# Altium project Matrix.PrjPcb
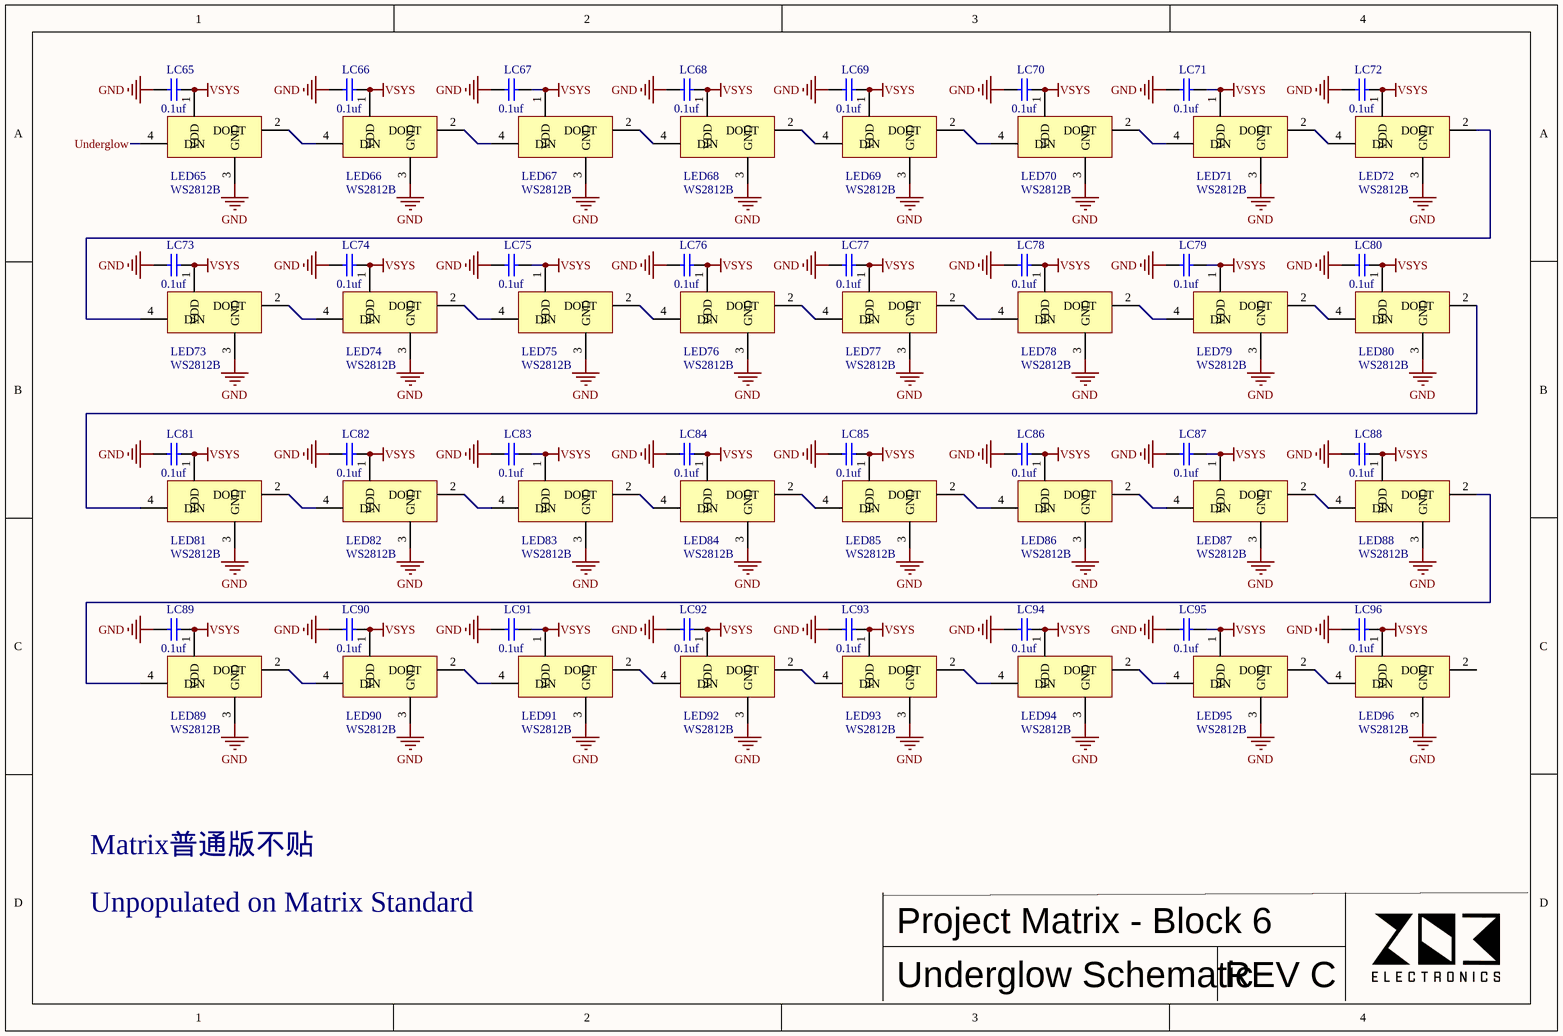
[diagram p0: Underglow.SchDoc]
4 sheets, 371 parts. Net scope: global (net labels, ports and power ports of the same name join across sheets).
Board files: TouchBarL.PcbDoc, Matrix.PcbDoc, TouchBarR.PcbDoc
Sheets:
  Underglow.SchDoc
  LED.SchDoc
  Main.SchDoc
  Keypad.SchDoc

## Sheet Underglow.SchDoc
size A4; SheetNumber: 1; SheetTotal: 4

### Parts
LC65  value 0.1uf  [0603 CAP]  (hidden comment: Cap Semi)
LC66  value 0.1uf  [0603 CAP]  (hidden comment: Cap Semi)
LC67  value 0.1uf  [0603 CAP]  (hidden comment: Cap Semi)
LC68  value 0.1uf  [0603 CAP]  (hidden comment: Cap Semi)
LC69  value 0.1uf  [0603 CAP]  (hidden comment: Cap Semi)
LC70  value 0.1uf  [0603 CAP]  (hidden comment: Cap Semi)
LC71  value 0.1uf  [0603 CAP]  (hidden comment: Cap Semi)
LC72  value 0.1uf  [0603 CAP]  (hidden comment: Cap Semi)
LC73  value 0.1uf  [0603 CAP]  (hidden comment: Cap Semi)
LC74  value 0.1uf  [0603 CAP]  (hidden comment: Cap Semi)
LC75  value 0.1uf  [0603 CAP]  (hidden comment: Cap Semi)
LC76  value 0.1uf  [0603 CAP]  (hidden comment: Cap Semi)
LC77  value 0.1uf  [0603 CAP]  (hidden comment: Cap Semi)
LC78  value 0.1uf  [0603 CAP]  (hidden comment: Cap Semi)
LC79  value 0.1uf  [0603 CAP]  (hidden comment: Cap Semi)
LC80  value 0.1uf  [0603 CAP]  (hidden comment: Cap Semi)
LC81  value 0.1uf  [0603 CAP]  (hidden comment: Cap Semi)
LC82  value 0.1uf  [0603 CAP]  (hidden comment: Cap Semi)
LC83  value 0.1uf  [0603 CAP]  (hidden comment: Cap Semi)
LC84  value 0.1uf  [0603 CAP]  (hidden comment: Cap Semi)
LC85  value 0.1uf  [0603 CAP]  (hidden comment: Cap Semi)
LC86  value 0.1uf  [0603 CAP]  (hidden comment: Cap Semi)
LC87  value 0.1uf  [0603 CAP]  (hidden comment: Cap Semi)
LC88  value 0.1uf  [0603 CAP]  (hidden comment: Cap Semi)
LC89  value 0.1uf  [0603 CAP]  (hidden comment: Cap Semi)
LC90  value 0.1uf  [0603 CAP]  (hidden comment: Cap Semi)
LC91  value 0.1uf  [0603 CAP]  (hidden comment: Cap Semi)
LC92  value 0.1uf  [0603 CAP]  (hidden comment: Cap Semi)
LC93  value 0.1uf  [0603 CAP]  (hidden comment: Cap Semi)
LC94  value 0.1uf  [0603 CAP]  (hidden comment: Cap Semi)
LC95  value 0.1uf  [0603 CAP]  (hidden comment: Cap Semi)
LC96  value 0.1uf  [0603 CAP]  (hidden comment: Cap Semi)
LED65  WS2812B  [3210 LED]
LED66  WS2812B  [3210 LED]
LED67  WS2812B  [3210 LED]
LED68  WS2812B  [3210 LED]
LED69  WS2812B  [3210 LED]
LED70  WS2812B  [3210 LED]
LED71  WS2812B  [3210 LED]
LED72  WS2812B  [3210 LED]
LED73  WS2812B  [3210 LED]
LED74  WS2812B  [3210 LED]
LED75  WS2812B  [3210 LED]
LED76  WS2812B  [3210 LED]
LED77  WS2812B  [3210 LED]
LED78  WS2812B  [3210 LED]
LED79  WS2812B  [3210 LED]
LED80  WS2812B  [3210 LED]
LED81  WS2812B  [3210 LED]
LED82  WS2812B  [3210 LED]
LED83  WS2812B  [3210 LED]
LED84  WS2812B  [3210 LED]
LED85  WS2812B  [3210 LED]
LED86  WS2812B  [3210 LED]
LED87  WS2812B  [3210 LED]
LED88  WS2812B  [3210 LED]
LED89  WS2812B  [3210 LED]
LED90  WS2812B  [3210 LED]
LED91  WS2812B  [3210 LED]
LED92  WS2812B  [3210 LED]
LED93  WS2812B  [3210 LED]
LED94  WS2812B  [3210 LED]
LED95  WS2812B  [3210 LED]
LED96  WS2812B  [3210 LED]

### Nets
GND: LC65.1 LC66.1 LC67.1 LC68.1 LC69.1 LC70.1 LC71.1 LC72.1 LC73.1 LC74.1 LC75.1 LC76.1 LC77.1 LC78.1 LC79.1 LC80.1 LC81.1 LC82.1 LC83.1 LC84.1 LC85.1 LC86.1 LC87.1 LC88.1 LC89.1 LC90.1 LC91.1 LC92.1 LC93.1 LC94.1 LC95.1 LC96.1 LED65.3(GND) LED66.3(GND) LED67.3(GND) LED68.3(GND) LED69.3(GND) LED70.3(GND) LED71.3(GND) LED72.3(GND) LED73.3(GND) LED74.3(GND) LED75.3(GND) LED76.3(GND) LED77.3(GND) LED78.3(GND) LED79.3(GND) LED80.3(GND) LED81.3(GND) LED82.3(GND) LED83.3(GND) LED84.3(GND) LED85.3(GND) LED86.3(GND) LED87.3(GND) LED88.3(GND) LED89.3(GND) LED90.3(GND) LED91.3(GND) LED92.3(GND) LED93.3(GND) LED94.3(GND) LED95.3(GND) LED96.3(GND)
VSYS: LC65.2 LC66.2 LC67.2 LC68.2 LC69.2 LC70.2 LC71.2 LC72.2 LC73.2 LC74.2 LC75.2 LC76.2 LC77.2 LC78.2 LC79.2 LC80.2 LC81.2 LC82.2 LC83.2 LC84.2 LC85.2 LC86.2 LC87.2 LC88.2 LC89.2 LC90.2 LC91.2 LC92.2 LC93.2 LC94.2 LC95.2 LC96.2 LED65.1(VDD) LED66.1(VDD) LED67.1(VDD) LED68.1(VDD) LED69.1(VDD) LED70.1(VDD) LED71.1(VDD) LED72.1(VDD) LED73.1(VDD) LED74.1(VDD) LED75.1(VDD) LED76.1(VDD) LED77.1(VDD) LED78.1(VDD) LED79.1(VDD) LED80.1(VDD) LED81.1(VDD) LED82.1(VDD) LED83.1(VDD) LED84.1(VDD) LED85.1(VDD) LED86.1(VDD) LED87.1(VDD) LED88.1(VDD) LED89.1(VDD) LED90.1(VDD) LED91.1(VDD) LED92.1(VDD) LED93.1(VDD) LED94.1(VDD) LED95.1(VDD) LED96.1(VDD)
Underglow: LED65.4(DIN)
NetLED65_2: LED65.2(DOUT) LED66.4(DIN)
NetLED66_2: LED66.2(DOUT) LED67.4(DIN)
NetLED67_2: LED67.2(DOUT) LED68.4(DIN)
NetLED68_2: LED68.2(DOUT) LED69.4(DIN)
NetLED69_2: LED69.2(DOUT) LED70.4(DIN)
NetLED70_2: LED70.2(DOUT) LED71.4(DIN)
NetLED71_2: LED71.2(DOUT) LED72.4(DIN)
NetLED72_2: LED72.2(DOUT) LED73.4(DIN)
NetLED73_2: LED73.2(DOUT) LED74.4(DIN)
NetLED74_2: LED74.2(DOUT) LED75.4(DIN)
NetLED75_2: LED75.2(DOUT) LED76.4(DIN)
NetLED76_2: LED76.2(DOUT) LED77.4(DIN)
NetLED77_2: LED77.2(DOUT) LED78.4(DIN)
NetLED78_2: LED78.2(DOUT) LED79.4(DIN)
NetLED79_2: LED79.2(DOUT) LED80.4(DIN)
NetLED80_2: LED80.2(DOUT) LED81.4(DIN)
NetLED81_2: LED81.2(DOUT) LED82.4(DIN)
NetLED82_2: LED82.2(DOUT) LED83.4(DIN)
NetLED83_2: LED83.2(DOUT) LED84.4(DIN)
NetLED84_2: LED84.2(DOUT) LED85.4(DIN)
NetLED85_2: LED85.2(DOUT) LED86.4(DIN)
NetLED86_2: LED86.2(DOUT) LED87.4(DIN)
NetLED87_2: LED87.2(DOUT) LED88.4(DIN)
NetLED88_2: LED88.2(DOUT) LED89.4(DIN)
NetLED89_2: LED89.2(DOUT) LED90.4(DIN)
NetLED90_2: LED90.2(DOUT) LED91.4(DIN)
NetLED91_2: LED91.2(DOUT) LED92.4(DIN)
NetLED92_2: LED92.2(DOUT) LED93.4(DIN)
NetLED93_2: LED93.2(DOUT) LED94.4(DIN)
NetLED94_2: LED94.2(DOUT) LED95.4(DIN)
NetLED95_2: LED95.2(DOUT) LED96.4(DIN)

Not connected (* = marked no-connect by the designer): LED96 2(DOUT)

### Notes on the sheet
- Matrix普通版不贴
- Unpopulated on Matrix Standard
- Project Matrix - Block 6
- Underglow Schematic
- REV C

### Library data of the parts
LC65-LC96 = Cap Semi: Capacitor (Semiconductor SIM Model); Published: 8-Jun-2000; LatestRevisionDate: 29-May-2009; LatestRevisionNote: IPC-7351 Footprint Added.; PackageReference: C1206; Publisher: Altium Limited; PackageDescription: Chip Capacitor
LED65-LED96 = WS2812B: 3535

## Sheet LED.SchDoc
size 304 x 330 mm; SheetNumber: 2; SheetTotal: 4
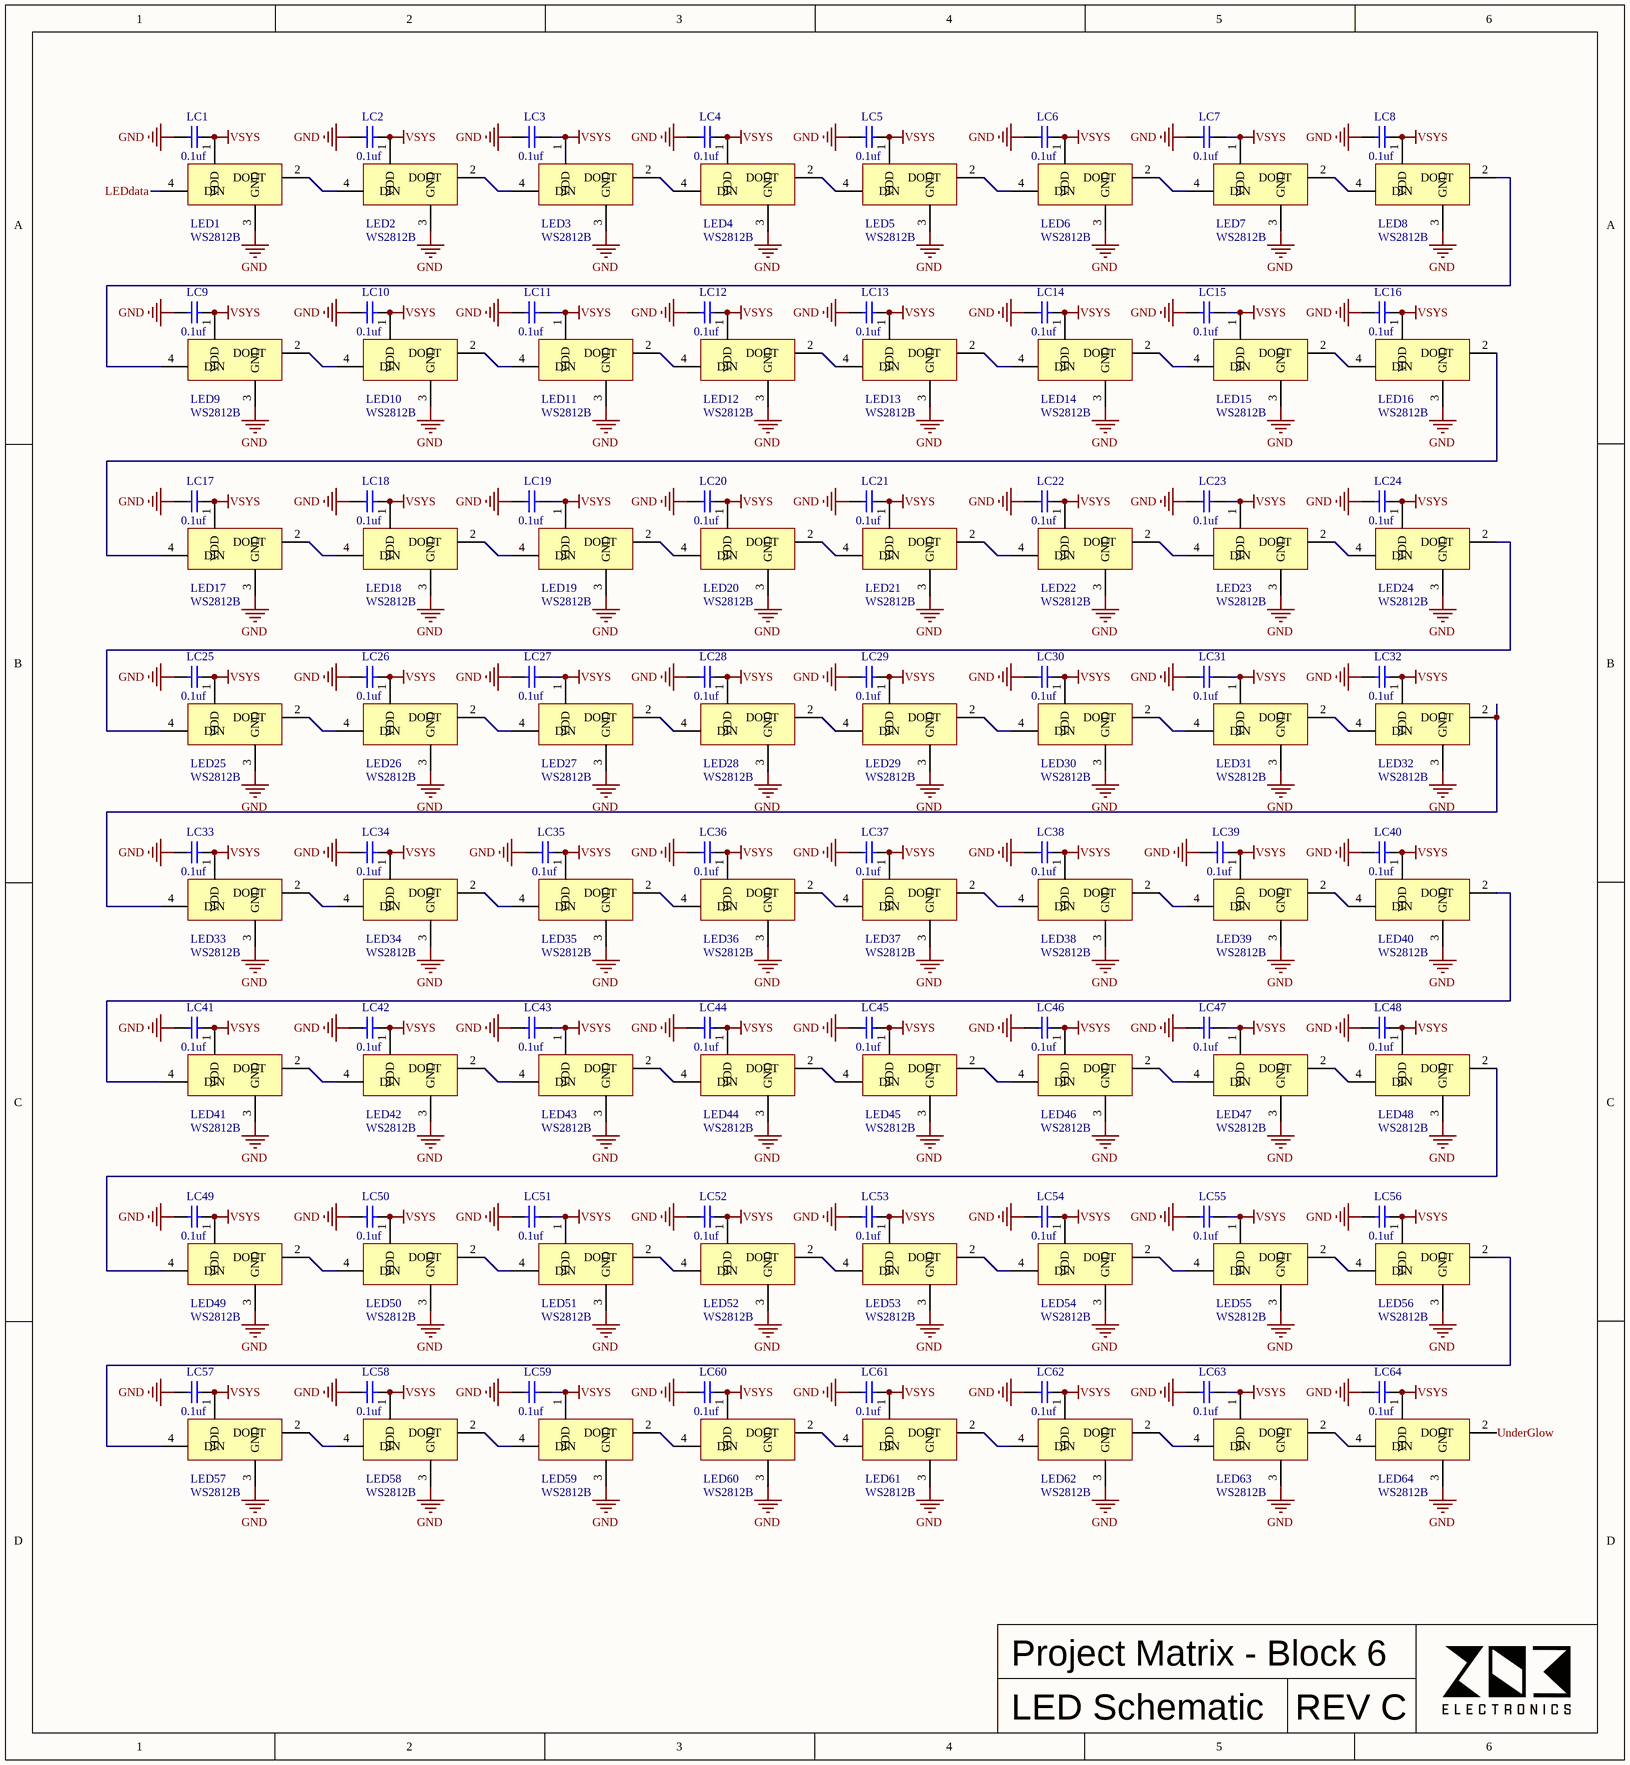
[diagram p1: LED.SchDoc]

### Parts
LC1  value 0.1uf  [0603 CAP]  (hidden comment: Cap Semi)
LC2  value 0.1uf  [0603 CAP]  (hidden comment: Cap Semi)
LC3  value 0.1uf  [0603 CAP]  (hidden comment: Cap Semi)
LC4  value 0.1uf  [0603 CAP]  (hidden comment: Cap Semi)
LC5  value 0.1uf  [0603 CAP]  (hidden comment: Cap Semi)
LC6  value 0.1uf  [0603 CAP]  (hidden comment: Cap Semi)
LC7  value 0.1uf  [0603 CAP]  (hidden comment: Cap Semi)
LC8  value 0.1uf  [0603 CAP]  (hidden comment: Cap Semi)
LC9  value 0.1uf  [0603 CAP]  (hidden comment: Cap Semi)
LC10  value 0.1uf  [0603 CAP]  (hidden comment: Cap Semi)
LC11  value 0.1uf  [0603 CAP]  (hidden comment: Cap Semi)
LC12  value 0.1uf  [0603 CAP]  (hidden comment: Cap Semi)
LC13  value 0.1uf  [0603 CAP]  (hidden comment: Cap Semi)
LC14  value 0.1uf  [0603 CAP]  (hidden comment: Cap Semi)
LC15  value 0.1uf  [0603 CAP]  (hidden comment: Cap Semi)
LC16  value 0.1uf  [0603 CAP]  (hidden comment: Cap Semi)
LC17  value 0.1uf  [0603 CAP]  (hidden comment: Cap Semi)
LC18  value 0.1uf  [0603 CAP]  (hidden comment: Cap Semi)
LC19  value 0.1uf  [0603 CAP]  (hidden comment: Cap Semi)
LC20  value 0.1uf  [0603 CAP]  (hidden comment: Cap Semi)
LC21  value 0.1uf  [0603 CAP]  (hidden comment: Cap Semi)
LC22  value 0.1uf  [0603 CAP]  (hidden comment: Cap Semi)
LC23  value 0.1uf  [0603 CAP]  (hidden comment: Cap Semi)
LC24  value 0.1uf  [0603 CAP]  (hidden comment: Cap Semi)
LC25  value 0.1uf  [0603 CAP]  (hidden comment: Cap Semi)
LC26  value 0.1uf  [0603 CAP]  (hidden comment: Cap Semi)
LC27  value 0.1uf  [0603 CAP]  (hidden comment: Cap Semi)
LC28  value 0.1uf  [0603 CAP]  (hidden comment: Cap Semi)
LC29  value 0.1uf  [0603 CAP]  (hidden comment: Cap Semi)
LC30  value 0.1uf  [0603 CAP]  (hidden comment: Cap Semi)
LC31  value 0.1uf  [0603 CAP]  (hidden comment: Cap Semi)
LC32  value 0.1uf  [0603 CAP]  (hidden comment: Cap Semi)
LC33  value 0.1uf  [0603 CAP]  (hidden comment: Cap Semi)
LC34  value 0.1uf  [0603 CAP]  (hidden comment: Cap Semi)
LC35  value 0.1uf  [0603 CAP]  (hidden comment: Cap Semi)
LC36  value 0.1uf  [0603 CAP]  (hidden comment: Cap Semi)
LC37  value 0.1uf  [0603 CAP]  (hidden comment: Cap Semi)
LC38  value 0.1uf  [0603 CAP]  (hidden comment: Cap Semi)
LC39  value 0.1uf  [0603 CAP]  (hidden comment: Cap Semi)
LC40  value 0.1uf  [0603 CAP]  (hidden comment: Cap Semi)
LC41  value 0.1uf  [0603 CAP]  (hidden comment: Cap Semi)
LC42  value 0.1uf  [0603 CAP]  (hidden comment: Cap Semi)
LC43  value 0.1uf  [0603 CAP]  (hidden comment: Cap Semi)
LC44  value 0.1uf  [0603 CAP]  (hidden comment: Cap Semi)
LC45  value 0.1uf  [0603 CAP]  (hidden comment: Cap Semi)
LC46  value 0.1uf  [0603 CAP]  (hidden comment: Cap Semi)
LC47  value 0.1uf  [0603 CAP]  (hidden comment: Cap Semi)
LC48  value 0.1uf  [0603 CAP]  (hidden comment: Cap Semi)
LC49  value 0.1uf  [0603 CAP]  (hidden comment: Cap Semi)
LC50  value 0.1uf  [0603 CAP]  (hidden comment: Cap Semi)
LC51  value 0.1uf  [0603 CAP]  (hidden comment: Cap Semi)
LC52  value 0.1uf  [0603 CAP]  (hidden comment: Cap Semi)
LC53  value 0.1uf  [0603 CAP]  (hidden comment: Cap Semi)
LC54  value 0.1uf  [0603 CAP]  (hidden comment: Cap Semi)
LC55  value 0.1uf  [0603 CAP]  (hidden comment: Cap Semi)
LC56  value 0.1uf  [0603 CAP]  (hidden comment: Cap Semi)
LC57  value 0.1uf  [0603 CAP]  (hidden comment: Cap Semi)
LC58  value 0.1uf  [0603 CAP]  (hidden comment: Cap Semi)
LC59  value 0.1uf  [0603 CAP]  (hidden comment: Cap Semi)
LC60  value 0.1uf  [0603 CAP]  (hidden comment: Cap Semi)
LC61  value 0.1uf  [0603 CAP]  (hidden comment: Cap Semi)
LC62  value 0.1uf  [0603 CAP]  (hidden comment: Cap Semi)
LC63  value 0.1uf  [0603 CAP]  (hidden comment: Cap Semi)
LC64  value 0.1uf  [0603 CAP]  (hidden comment: Cap Semi)
LED1  WS2812B  [WS2812B]
LED2  WS2812B  [WS2812B]
LED3  WS2812B  [WS2812B]
LED4  WS2812B  [WS2812B]
LED5  WS2812B  [WS2812B]
LED6  WS2812B  [WS2812B]
LED7  WS2812B  [WS2812B]
LED8  WS2812B  [WS2812B]
LED9  WS2812B  [WS2812B]
LED10  WS2812B  [WS2812B]
LED11  WS2812B  [WS2812B]
LED12  WS2812B  [WS2812B]
LED13  WS2812B  [WS2812B]
LED14  WS2812B  [WS2812B]
LED15  WS2812B  [WS2812B]
LED16  WS2812B  [WS2812B]
LED17  WS2812B  [WS2812B]
LED18  WS2812B  [WS2812B]
LED19  WS2812B  [WS2812B]
LED20  WS2812B  [WS2812B]
LED21  WS2812B  [WS2812B]
LED22  WS2812B  [WS2812B]
LED23  WS2812B  [WS2812B]
LED24  WS2812B  [WS2812B]
LED25  WS2812B  [WS2812B]
LED26  WS2812B  [WS2812B]
LED27  WS2812B  [WS2812B]
LED28  WS2812B  [WS2812B]
LED29  WS2812B  [WS2812B]
LED30  WS2812B  [WS2812B]
LED31  WS2812B  [WS2812B]
LED32  WS2812B  [WS2812B]
LED33  WS2812B  [WS2812B]
LED34  WS2812B  [WS2812B]
LED35  WS2812B  [WS2812B]
LED36  WS2812B  [WS2812B]
LED37  WS2812B  [WS2812B]
LED38  WS2812B  [WS2812B]
LED39  WS2812B  [WS2812B]
LED40  WS2812B  [WS2812B]
LED41  WS2812B  [WS2812B]
LED42  WS2812B  [WS2812B]
LED43  WS2812B  [WS2812B]
LED44  WS2812B  [WS2812B]
LED45  WS2812B  [WS2812B]
LED46  WS2812B  [WS2812B]
LED47  WS2812B  [WS2812B]
LED48  WS2812B  [WS2812B]
LED49  WS2812B  [WS2812B]
LED50  WS2812B  [WS2812B]
LED51  WS2812B  [WS2812B]
LED52  WS2812B  [WS2812B]
LED53  WS2812B  [WS2812B]
LED54  WS2812B  [WS2812B]
LED55  WS2812B  [WS2812B]
LED56  WS2812B  [WS2812B]
LED57  WS2812B  [WS2812B]
LED58  WS2812B  [WS2812B]
LED59  WS2812B  [WS2812B]
LED60  WS2812B  [WS2812B]
LED61  WS2812B  [WS2812B]
LED62  WS2812B  [WS2812B]
LED63  WS2812B  [WS2812B]
LED64  WS2812B  [WS2812B]

### Nets
GND: LC1.1 LC2.1 LC3.1 LC4.1 LC5.1 LC6.1 LC7.1 LC8.1 LC9.1 LC10.1 LC11.1 LC12.1 LC13.1 LC14.1 LC15.1 LC16.1 LC17.1 LC18.1 LC19.1 LC20.1 LC21.1 LC22.1 LC23.1 LC24.1 LC25.1 LC26.1 LC27.1 LC28.1 LC29.1 LC30.1 LC31.1 LC32.1 LC33.1 LC34.1 LC35.1 LC36.1 LC37.1 LC38.1 LC39.1 LC40.1 LC41.1 LC42.1 LC43.1 LC44.1 LC45.1 LC46.1 LC47.1 LC48.1 LC49.1 LC50.1 LC51.1 LC52.1 LC53.1 LC54.1 LC55.1 LC56.1 LC57.1 LC58.1 LC59.1 LC60.1 LC61.1 LC62.1 LC63.1 LC64.1 LED1.3(GND) LED2.3(GND) LED3.3(GND) LED4.3(GND) LED5.3(GND) LED6.3(GND) LED7.3(GND) LED8.3(GND) LED9.3(GND) LED10.3(GND) LED11.3(GND) LED12.3(GND) LED13.3(GND) LED14.3(GND) LED15.3(GND) LED16.3(GND) LED17.3(GND) LED18.3(GND) LED19.3(GND) LED20.3(GND) LED21.3(GND) LED22.3(GND) LED23.3(GND) LED24.3(GND) LED25.3(GND) LED26.3(GND) LED27.3(GND) LED28.3(GND) LED29.3(GND) LED30.3(GND) LED31.3(GND) LED32.3(GND) LED33.3(GND) LED34.3(GND) LED35.3(GND) LED36.3(GND) LED37.3(GND) LED38.3(GND) LED39.3(GND) LED40.3(GND) LED41.3(GND) LED42.3(GND) LED43.3(GND) LED44.3(GND) LED45.3(GND) LED46.3(GND) LED47.3(GND) LED48.3(GND) LED49.3(GND) LED50.3(GND) LED51.3(GND) LED52.3(GND) LED53.3(GND) LED54.3(GND) LED55.3(GND) LED56.3(GND) LED57.3(GND) LED58.3(GND) LED59.3(GND) LED60.3(GND) LED61.3(GND) LED62.3(GND) LED63.3(GND) LED64.3(GND)
VSYS: LC1.2 LC2.2 LC3.2 LC4.2 LC5.2 LC6.2 LC7.2 LC8.2 LC9.2 LC10.2 LC11.2 LC12.2 LC13.2 LC14.2 LC15.2 LC16.2 LC17.2 LC18.2 LC19.2 LC20.2 LC21.2 LC22.2 LC23.2 LC24.2 LC25.2 LC26.2 LC27.2 LC28.2 LC29.2 LC30.2 LC31.2 LC32.2 LC33.2 LC34.2 LC35.2 LC36.2 LC37.2 LC38.2 LC39.2 LC40.2 LC41.2 LC42.2 LC43.2 LC44.2 LC45.2 LC46.2 LC47.2 LC48.2 LC49.2 LC50.2 LC51.2 LC52.2 LC53.2 LC54.2 LC55.2 LC56.2 LC57.2 LC58.2 LC59.2 LC60.2 LC61.2 LC62.2 LC63.2 LC64.2 LED1.1(VDD) LED2.1(VDD) LED3.1(VDD) LED4.1(VDD) LED5.1(VDD) LED6.1(VDD) LED7.1(VDD) LED8.1(VDD) LED9.1(VDD) LED10.1(VDD) LED11.1(VDD) LED12.1(VDD) LED13.1(VDD) LED14.1(VDD) LED15.1(VDD) LED16.1(VDD) LED17.1(VDD) LED18.1(VDD) LED19.1(VDD) LED20.1(VDD) LED21.1(VDD) LED22.1(VDD) LED23.1(VDD) LED24.1(VDD) LED25.1(VDD) LED26.1(VDD) LED27.1(VDD) LED28.1(VDD) LED29.1(VDD) LED30.1(VDD) LED31.1(VDD) LED32.1(VDD) LED33.1(VDD) LED34.1(VDD) LED35.1(VDD) LED36.1(VDD) LED37.1(VDD) LED38.1(VDD) LED39.1(VDD) LED40.1(VDD) LED41.1(VDD) LED42.1(VDD) LED43.1(VDD) LED44.1(VDD) LED45.1(VDD) LED46.1(VDD) LED47.1(VDD) LED48.1(VDD) LED49.1(VDD) LED50.1(VDD) LED51.1(VDD) LED52.1(VDD) LED53.1(VDD) LED54.1(VDD) LED55.1(VDD) LED56.1(VDD) LED57.1(VDD) LED58.1(VDD) LED59.1(VDD) LED60.1(VDD) LED61.1(VDD) LED62.1(VDD) LED63.1(VDD) LED64.1(VDD)
LEDdata: LED1.4(DIN)
Underglow: LED64.2(DOUT)
NetLED1_2: LED1.2(DOUT) LED2.4(DIN)
NetLED2_2: LED2.2(DOUT) LED3.4(DIN)
NetLED3_2: LED3.2(DOUT) LED4.4(DIN)
NetLED4_2: LED4.2(DOUT) LED5.4(DIN)
NetLED5_2: LED5.2(DOUT) LED6.4(DIN)
NetLED6_2: LED6.2(DOUT) LED7.4(DIN)
NetLED7_2: LED7.2(DOUT) LED8.4(DIN)
NetLED8_2: LED8.2(DOUT) LED9.4(DIN)
NetLED9_2: LED9.2(DOUT) LED10.4(DIN)
NetLED10_2: LED10.2(DOUT) LED11.4(DIN)
NetLED11_2: LED11.2(DOUT) LED12.4(DIN)
NetLED12_2: LED12.2(DOUT) LED13.4(DIN)
NetLED13_2: LED13.2(DOUT) LED14.4(DIN)
NetLED14_2: LED14.2(DOUT) LED15.4(DIN)
NetLED15_2: LED15.2(DOUT) LED16.4(DIN)
NetLED16_2: LED16.2(DOUT) LED17.4(DIN)
NetLED17_2: LED17.2(DOUT) LED18.4(DIN)
NetLED18_2: LED18.2(DOUT) LED19.4(DIN)
NetLED19_2: LED19.2(DOUT) LED20.4(DIN)
NetLED20_2: LED20.2(DOUT) LED21.4(DIN)
NetLED21_2: LED21.2(DOUT) LED22.4(DIN)
NetLED22_2: LED22.2(DOUT) LED23.4(DIN)
NetLED23_2: LED23.2(DOUT) LED24.4(DIN)
NetLED24_2: LED24.2(DOUT) LED25.4(DIN)
NetLED25_2: LED25.2(DOUT) LED26.4(DIN)
NetLED26_2: LED26.2(DOUT) LED27.4(DIN)
NetLED27_2: LED27.2(DOUT) LED28.4(DIN)
NetLED28_2: LED28.2(DOUT) LED29.4(DIN)
NetLED29_2: LED29.2(DOUT) LED30.4(DIN)
NetLED30_2: LED30.2(DOUT) LED31.4(DIN)
NetLED31_2: LED31.2(DOUT) LED32.4(DIN)
NetLED32_2: LED32.2(DOUT) LED33.4(DIN)
NetLED33_2: LED33.2(DOUT) LED34.4(DIN)
NetLED34_2: LED34.2(DOUT) LED35.4(DIN)
NetLED35_2: LED35.2(DOUT) LED36.4(DIN)
NetLED36_2: LED36.2(DOUT) LED37.4(DIN)
NetLED37_2: LED37.2(DOUT) LED38.4(DIN)
NetLED38_2: LED38.2(DOUT) LED39.4(DIN)
NetLED39_2: LED39.2(DOUT) LED40.4(DIN)
NetLED40_2: LED40.2(DOUT) LED41.4(DIN)
NetLED41_2: LED41.2(DOUT) LED42.4(DIN)
NetLED42_2: LED42.2(DOUT) LED43.4(DIN)
NetLED43_2: LED43.2(DOUT) LED44.4(DIN)
NetLED44_2: LED44.2(DOUT) LED45.4(DIN)
NetLED45_2: LED45.2(DOUT) LED46.4(DIN)
NetLED46_2: LED46.2(DOUT) LED47.4(DIN)
NetLED47_2: LED47.2(DOUT) LED48.4(DIN)
NetLED48_2: LED48.2(DOUT) LED49.4(DIN)
NetLED49_2: LED49.2(DOUT) LED50.4(DIN)
NetLED50_2: LED50.2(DOUT) LED51.4(DIN)
NetLED51_2: LED51.2(DOUT) LED52.4(DIN)
NetLED52_2: LED52.2(DOUT) LED53.4(DIN)
NetLED53_2: LED53.2(DOUT) LED54.4(DIN)
NetLED54_2: LED54.2(DOUT) LED55.4(DIN)
NetLED55_2: LED55.2(DOUT) LED56.4(DIN)
NetLED56_2: LED56.2(DOUT) LED57.4(DIN)
NetLED57_2: LED57.2(DOUT) LED58.4(DIN)
NetLED58_2: LED58.2(DOUT) LED59.4(DIN)
NetLED59_2: LED59.2(DOUT) LED60.4(DIN)
NetLED60_2: LED60.2(DOUT) LED61.4(DIN)
NetLED61_2: LED61.2(DOUT) LED62.4(DIN)
NetLED62_2: LED62.2(DOUT) LED63.4(DIN)
NetLED63_2: LED63.2(DOUT) LED64.4(DIN)

### Notes on the sheet
- Project Matrix - Block 6
- LED Schematic
- REV C

### Library data of the parts
LC1-LC64 = Cap Semi: Capacitor (Semiconductor SIM Model); Published: 8-Jun-2000; LatestRevisionDate: 29-May-2009; LatestRevisionNote: IPC-7351 Footprint Added.; PackageReference: C1206; Publisher: Altium Limited; PackageDescription: Chip Capacitor
LED1-LED64 = WS2812B: 3535

## Sheet Main.SchDoc: 203 Matrix - Core
size 320 x 193 mm; Revision: FE V1.0; SheetNumber: 3; SheetTotal: 4
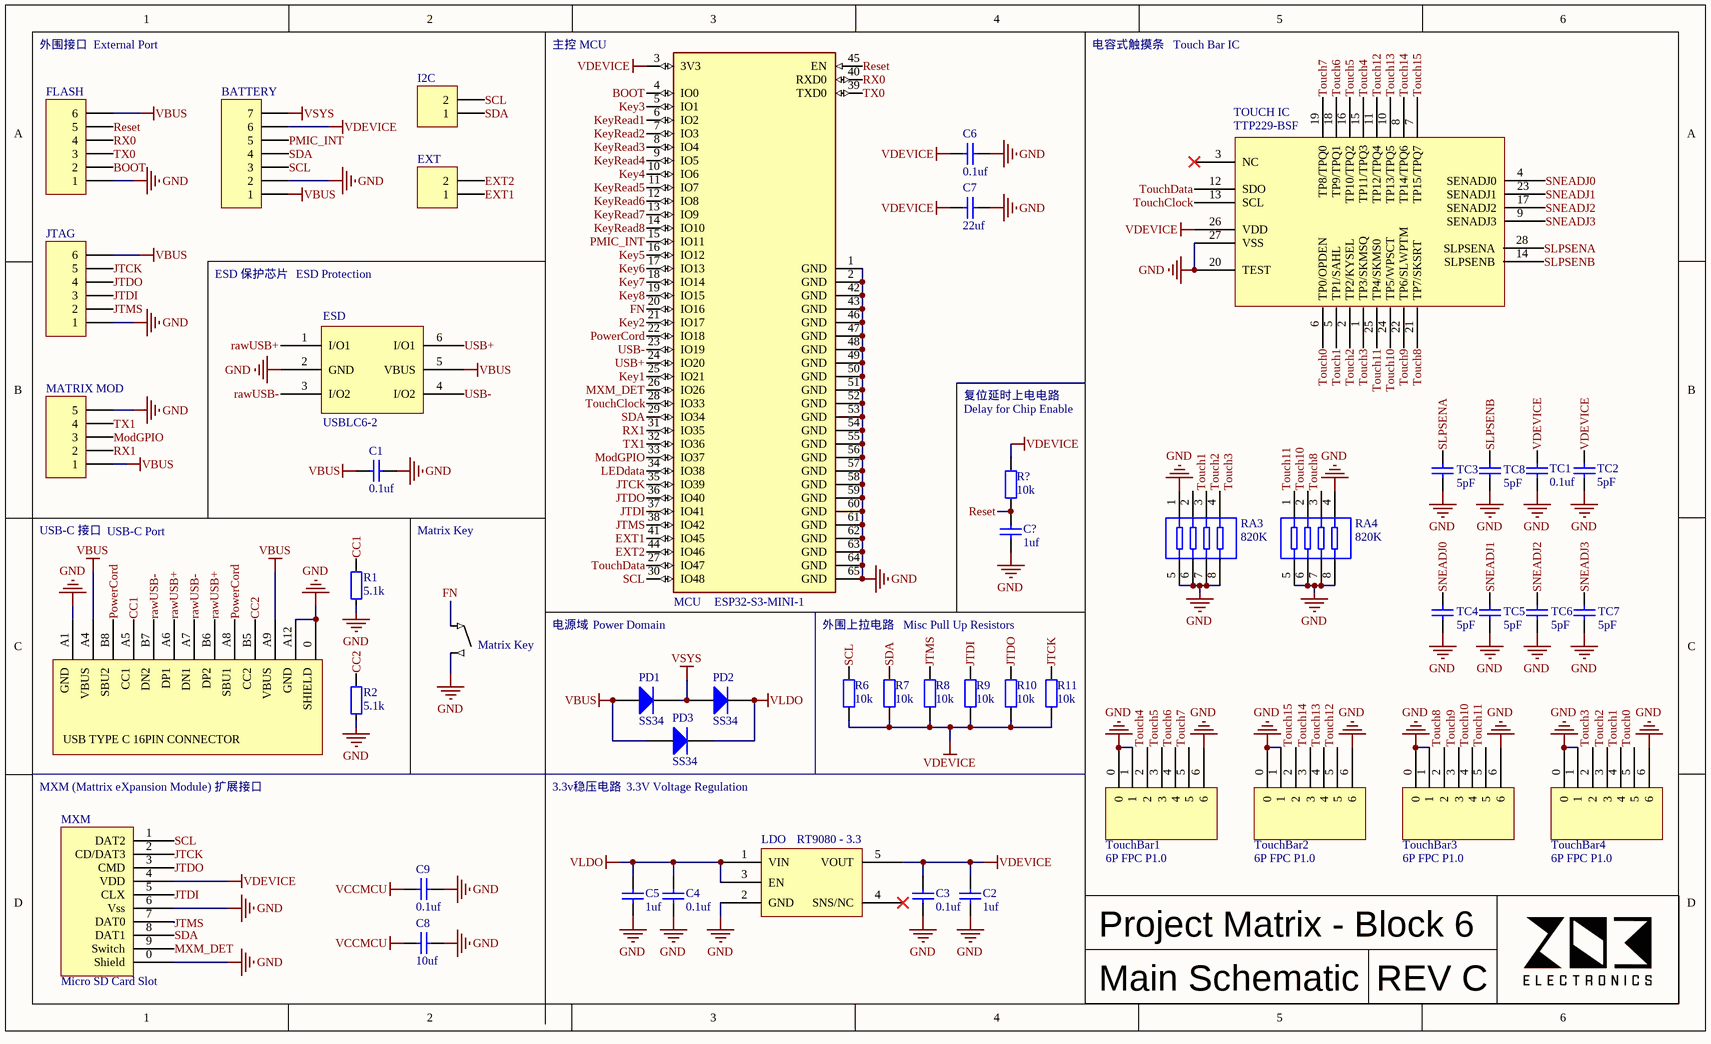
[diagram p2: Main.SchDoc]

### Parts
(Parts that share a designator on the sheet are numbered #1, #2 ... from top to bottom, then left to right.)
BATTERY  (no value)  [HDR1X7]
C1  value 0.1uf  [0603 CAP]  (hidden comment: MCU)
C2  value 1uf  [0603 CAP]  (hidden comment: MCU)
C3  value 0.1uf  [0603 CAP]  (hidden comment: MCU)
C4  value 0.1uf  [0603 CAP]  (hidden comment: MCU)
C5  value 1uf  [0603 CAP]  (hidden comment: MCU)
C6  value 0.1uf  [0603 CAP]  (hidden comment: MCU)
C7  value 22uf  [0603 CAP]  (hidden comment: LDO)
C8  value 10uf  [0603 CAP]  (hidden comment: MCU)
C9  value 0.1uf  [0603 CAP]  (hidden comment: MCU)
C?  value 1uf  [0603 CAP]  (hidden comment: LDO)
ESD  USBLC6-2  [SOT23-6L]
EXT  Header 2  [HDR1X2]  (value not drawn)
I2C  Header 2  [HDR1X2]  (value not drawn)
JTAG#1  FLASH  [HDR1X6]
JTAG#2  Interface to flash ESP  [HDR1X6]  (value not drawn)
LDO  RT9080 - 3.3  [SOT23-5]
Matrix_Key  Comment  [sw5x5]  (value not drawn)
MATRIX_MOD  MHDR1X5  [MHDR1X5]  (value not drawn)
MCU  ESP32-S3-MINI-1  [ESP32-S3-MINI-1]
MXM  Micro SD Card Slot  [TF Slot 2]
PD1  SS34  [SOD123]
PD2  SS34  [SOD123]
PD3  SS34  [SOD123]
R1  value 5.1k  [0603 res]  (hidden comment: MCU)
R2  value 5.1k  [0603 res]  (hidden comment: MCU)
R6  value 10k  [0603 res]  (hidden comment: MCU)
R7  value 10k  [0603 res]  (hidden comment: MCU)
R8  value 10k  [0603 res]  (hidden comment: MCU)
R9  value 10k  [0603 res]  (hidden comment: MCU)
R10  value 10k  [0603 res]  (hidden comment: MCU)
R11  value 10k  [0603 res]  (hidden comment: MCU)
R?  value 10k  [0603 res]  (hidden comment: MCU)
RA3  value 820K  [8P4R]  (hidden comment: Touch Bar)
RA4  value 820K  [8P4R]  (hidden comment: Touch Bar)
TC1  value 0.1uf  [0603 CAP]  (hidden comment: Touch Bar)
TC2  value 5pF  [0603 CAP]  (hidden comment: Touch Bar)
TC3  value 5pF  [0603 CAP]  (hidden comment: Touch Bar)
TC4  value 5pF  [0603 CAP]  (hidden comment: Touch Bar)
TC5  value 5pF  [0603 CAP]  (hidden comment: Touch Bar)
TC6  value 5pF  [0603 CAP]  (hidden comment: Touch Bar)
TC7  value 5pF  [0603 CAP]  (hidden comment: Touch Bar)
TC8  value 5pF  [0603 CAP]  (hidden comment: Touch Bar)
TOUCH_IC  TTP229-BSF  [SSOP-28]
TouchBar1  6P FPC P1.0  [6Pin FPC 1.0mm]
TouchBar2  6P FPC P1.0  [6Pin FPC 1.0mm]
TouchBar3  6P FPC P1.0  [6Pin FPC 1.0mm]
TouchBar4  6P FPC P1.0  [6Pin FPC 1.0mm]
USB-C  USBC 16PIN  [USBC short]  (value not drawn)

### Nets
GND: BATTERY.2 C1.1 C2.1 C3.1 C4.2 C5.2 C6.1 C7.1 C8.2 C9.2 C?.2 ESD.2(GND) JTAG#1.1 JTAG#2.1 LDO.2(GND) Matrix_Key.2(Out) MATRIX_MOD.5 MCU.1(GND) MCU.2(GND) MCU.42(GND) MCU.43(GND) MCU.46(GND) MCU.47(GND) MCU.48(GND) MCU.49(GND) MCU.50(GND) MCU.51(GND) MCU.52(GND) MCU.53(GND) MCU.54(GND) MCU.55(GND) MCU.56(GND) MCU.57(GND) MCU.58(GND) MCU.59(GND) MCU.60(GND) MCU.61(GND) MCU.62(GND) MCU.63(GND) MCU.64(GND) MCU.65(GND) MXM.0(Shield) MXM.6(Vss) R1.2 R2.1 RA3.1 RA3.5 RA3.6 RA3.7 RA3.8 RA4.4 RA4.5 RA4.6 RA4.7 RA4.8 TC1.1 TC2.1 TC3.1 TC4.1 TC5.1 TC6.1 TC7.1 TC8.1 TOUCH_IC.20(TEST) TOUCH_IC.27(VSS) TouchBar1.0 TouchBar1.1 TouchBar1.6 TouchBar2.0 TouchBar2.1 TouchBar2.6 TouchBar3.0 TouchBar3.1 TouchBar3.6 TouchBar4.0 TouchBar4.1 TouchBar4.6 USB-C.0 USB-C.A1 USB-C.A12
VBUS: BATTERY.1 C1.2 ESD.5(VBUS) JTAG#1.6 JTAG#2.6 MATRIX_MOD.1 PD1.1(A) PD3.1(A) USB-C.A4 USB-C.A9
VCCMCU: C8.1 C9.1
VDEVICE: BATTERY.6 C2.2 C3.2 C6.2 C7.2 LDO.5(VOUT) MCU.3(3V3) MXM.4(VDD) R6.1 R7.1 R8.1 R9.1 R10.1 R11.1 R?.1 TC1.2 TC2.2 TOUCH_IC.26(VDD)
VLDO: C4.1 C5.1 LDO.1(VIN) LDO.3(EN) PD2.2(K) PD3.2(K)
VSYS: BATTERY.7 PD1.2(K) PD2.1(A)
BOOT: JTAG#1.2 MCU.4(IO0)
CC1: R1.1 USB-C.A5
CC2: R2.2 USB-C.B5
EXT1: EXT.1 MCU.41(IO45)
EXT2: EXT.2 MCU.44(IO46)
FN: Matrix_Key.1 MCU.20(IO16)
JTCK: JTAG#2.5 MCU.35(IO39) MXM.2(CD/DAT3) R11.2
JTDI: JTAG#2.3 MCU.37(IO41) MXM.5(CLX) R9.2
JTDO: JTAG#2.4 MCU.36(IO40) MXM.3(CMD) R10.2
JTMS: JTAG#2.2 MCU.38(IO42) MXM.7(DAT0) R8.2
Key1: MCU.25(IO21)
Key2: MCU.21(IO17)
Key3: MCU.5(IO1)
Key4: MCU.10(IO6)
Key5: MCU.16(IO12)
Key6: MCU.17(IO13)
Key7: MCU.18(IO14)
Key8: MCU.19(IO15)
KeyRead1: MCU.6(IO2)
KeyRead2: MCU.7(IO3)
KeyRead3: MCU.8(IO4)
KeyRead4: MCU.9(IO5)
KeyRead5: MCU.11(IO7)
KeyRead6: MCU.12(IO8)
KeyRead7: MCU.13(IO9)
KeyRead8: MCU.14(IO10)
LEDdata: MCU.34(IO38)
ModGPIO: MATRIX_MOD.3 MCU.33(IO37)
MXM_DET: MCU.26(IO26) MXM.9(Switch)
PMIC_INT: BATTERY.5 MCU.15(IO11)
PowerCord: MCU.22(IO18) USB-C.A8 USB-C.B8
rawUSB+: ESD.1(I/O1) USB-C.A6 USB-C.B6
rawUSB-: ESD.3(I/O2) USB-C.A7 USB-C.B7
Reset: C?.1 JTAG#1.5 MCU.45(EN) R?.2
RX0: JTAG#1.4 MCU.40(RXD0)
RX1: MATRIX_MOD.2 MCU.31(IO35)
SCL: BATTERY.3 I2C.2 MCU.30(IO48) MXM.1(DAT2) R6.2
SDA: BATTERY.4 I2C.1 MCU.29(IO34) MXM.8(DAT1) R7.2
SLPSENA: TC3.2 TOUCH_IC.28(SLPSENA)
SLPSENB: TC8.2 TOUCH_IC.14(SLPSENB)
SNEADJ0: TC4.2 TOUCH_IC.4(SENADJ0)
SNEADJ1: TC5.2 TOUCH_IC.23(SENADJ1)
SNEADJ2: TC6.2 TOUCH_IC.17(SENADJ2)
SNEADJ3: TC7.2 TOUCH_IC.9(SENADJ3)
Touch0: TOUCH_IC.6(TP0/OPDEN) TouchBar4.5
Touch1: RA3.2 TOUCH_IC.5(TP1/SAHL) TouchBar4.4
Touch2: RA3.3 TOUCH_IC.2(TP2/KYSEL) TouchBar4.3
Touch3: RA3.4 TOUCH_IC.1(TP3/SKMSQ) TouchBar4.2
Touch4: TOUCH_IC.15(TP11/TPQ3) TouchBar1.2
Touch5: TOUCH_IC.16(TP10/TPQ2) TouchBar1.3
Touch6: TOUCH_IC.18(TP9/TPQ1) TouchBar1.4
Touch7: TOUCH_IC.19(TP8/TPQ0) TouchBar1.5
Touch8: RA4.3 TOUCH_IC.21(TP7/SKSRT) TouchBar3.2
Touch9: TOUCH_IC.22(TP6/SLWPTM) TouchBar3.3
Touch10: RA4.2 TOUCH_IC.24(TP5/WPSCT) TouchBar3.4
Touch11: RA4.1 TOUCH_IC.25(TP4/SKMS0) TouchBar3.5
Touch12: TOUCH_IC.11(TP12/TPQ4) TouchBar2.5
Touch13: TOUCH_IC.10(TP13/TPQ5) TouchBar2.4
Touch14: TOUCH_IC.8(TP14/TPQ6) TouchBar2.3
Touch15: TOUCH_IC.7(TP15/TPQ7) TouchBar2.2
TouchClock: MCU.28(IO33) TOUCH_IC.13(SCL)
TouchData: MCU.27(IO47) TOUCH_IC.12(SDO)
TX0: JTAG#1.3 MCU.39(TXD0)
TX1: MATRIX_MOD.4 MCU.32(IO36)
USB+: ESD.6(I/O1) MCU.24(IO20)
USB-: ESD.4(I/O2) MCU.23(IO19)

Not connected (* = marked no-connect by the designer): LDO 4(SNS/NC)*; TOUCH_IC 3(NC)*

### Notes on the sheet
- 外围接口
- External Port
- 主控 MCU
- 电容式触摸条
- Touch Bar IC
- ESD 保护芯片
- ESD Protection
- 复位延时上电电路
- Delay for Chip Enable
- USB-C 接口
- USB-C Port
- Matrix Key
- 电源域
- (near MCU) Power Domain
- 外围上拉电路
- Misc Pull Up Resistors
- (near MXM) MXM (Mattrix eXpansion Module) 扩展接口
- 3.3v稳压电路
- (near PD3) 3.3V Voltage Regulation
- Project Matrix - Block 6
- Main Schematic
- REV C
- (in symbol USBC 16PIN) GND; VBUS; SBU2; CC1; DN2; DP1; DN1; DP2; SBU1; CC2; SHIELD; USB TYPE C 16PIN CONNECTOR

### Library data of the parts
BATTERY = Header 7: Header, 7-Pin; LatestRevisionDate: 17-Jul-2002; LatestRevisionNote: Re-released for DXP Platform.; Publisher: Altium Limited
C1-C9 C? = Cap: Published: 8-Jun-2000; LatestRevisionDate: 17-Jul-2002; LatestRevisionNote: Re-released for DXP Platform.; PackageReference: RAD-0.3; Publisher: Altium Limited; PackageDescription: Radial Cap, Thru-Hole; 2 Leads; 0.3 in Pin Spacing
EXT I2C = Header 2: Header, 2-Pin; LatestRevisionDate: 17-Jul-2002; LatestRevisionNote: Re-released for DXP Platform.; Publisher: Altium Limited
JTAG#1 JTAG#2 = MHDR1X6: Header, 6-Pin; LatestRevisionDate: 17-Jul-2002; LatestRevisionNote: Re-released for DXP Platform.; Publisher: Altium Limited
LDO = RT9080
Matrix_Key = SW: System
MATRIX_MOD = MHDR1X5: MCU; LatestRevisionDate: 17-Jul-2002; LatestRevisionNote: Re-released for DXP Platform.; Publisher: Altium Limited
MXM = SD Card with Switch
PD1-PD3 = Diode 1N4934: 1 Amp Fast Recovery Rectifier; Published: 8-Jun-2000; LatestRevisionDate: 17-Jul-2002; LatestRevisionNote: Re-released for DXP Platform.; DatasheetVersion: 1999; PackageVersion: Aug-1999; PackageReference: DO-41; Publisher: Altium Limited; PackageDescription: Diode, Axial; Body 5.2 x 2.7 mm (LxDia. max), Lead Dia. 0.86 mm (max); Code_JEDEC: DO-204-AL; ComponentLink1Description: Manufacturer Link; ComponentLink1URL: http://www.fairchildsemi.com/; ComponentLink2Description: Datasheet; ComponentLink2URL: http://www.fairchildsemi.com/ds/1N%2F1N4934.pdf
R1 R2 R6-R11 R? = Res2: Published: 8-Jun-2000; LatestRevisionDate: 17-Jul-2002; LatestRevisionNote: Re-released for DXP Platform.; PackageReference: AXIAL-0.4; Publisher: Altium Limited; PackageDescription: Axial Device, Thru-Hole; 2 Leads; 0.4 in Pin Spacing
RA3 RA4 = 4R8P Resistor
TC1 TC2 = Cap: Needs to be NR0; Published: 8-Jun-2000; LatestRevisionDate: 17-Jul-2002; LatestRevisionNote: Re-released for DXP Platform.; PackageReference: RAD-0.3; Publisher: Altium Limited; PackageDescription: Radial Cap, Thru-Hole; 2 Leads; 0.3 in Pin Spacing
TC3-TC8 = Cap: 需要用NR0材料 Needs to be NR0; Published: 8-Jun-2000; LatestRevisionDate: 17-Jul-2002; LatestRevisionNote: Re-released for DXP Platform.; PackageReference: RAD-0.3; Publisher: Altium Limited; PackageDescription: Radial Cap, Thru-Hole; 2 Leads; 0.3 in Pin Spacing
TouchBar1-TouchBar4 = 6 pin fpc
USB-C = USBC 16PIN: MCU; Value: 沉板1.6mm D6.5
TOUCH_IC = TTP229-BSF: Value: TTP229-BSF

## Sheet Keypad.SchDoc
size A4; SheetNumber: 4; SheetTotal: 4
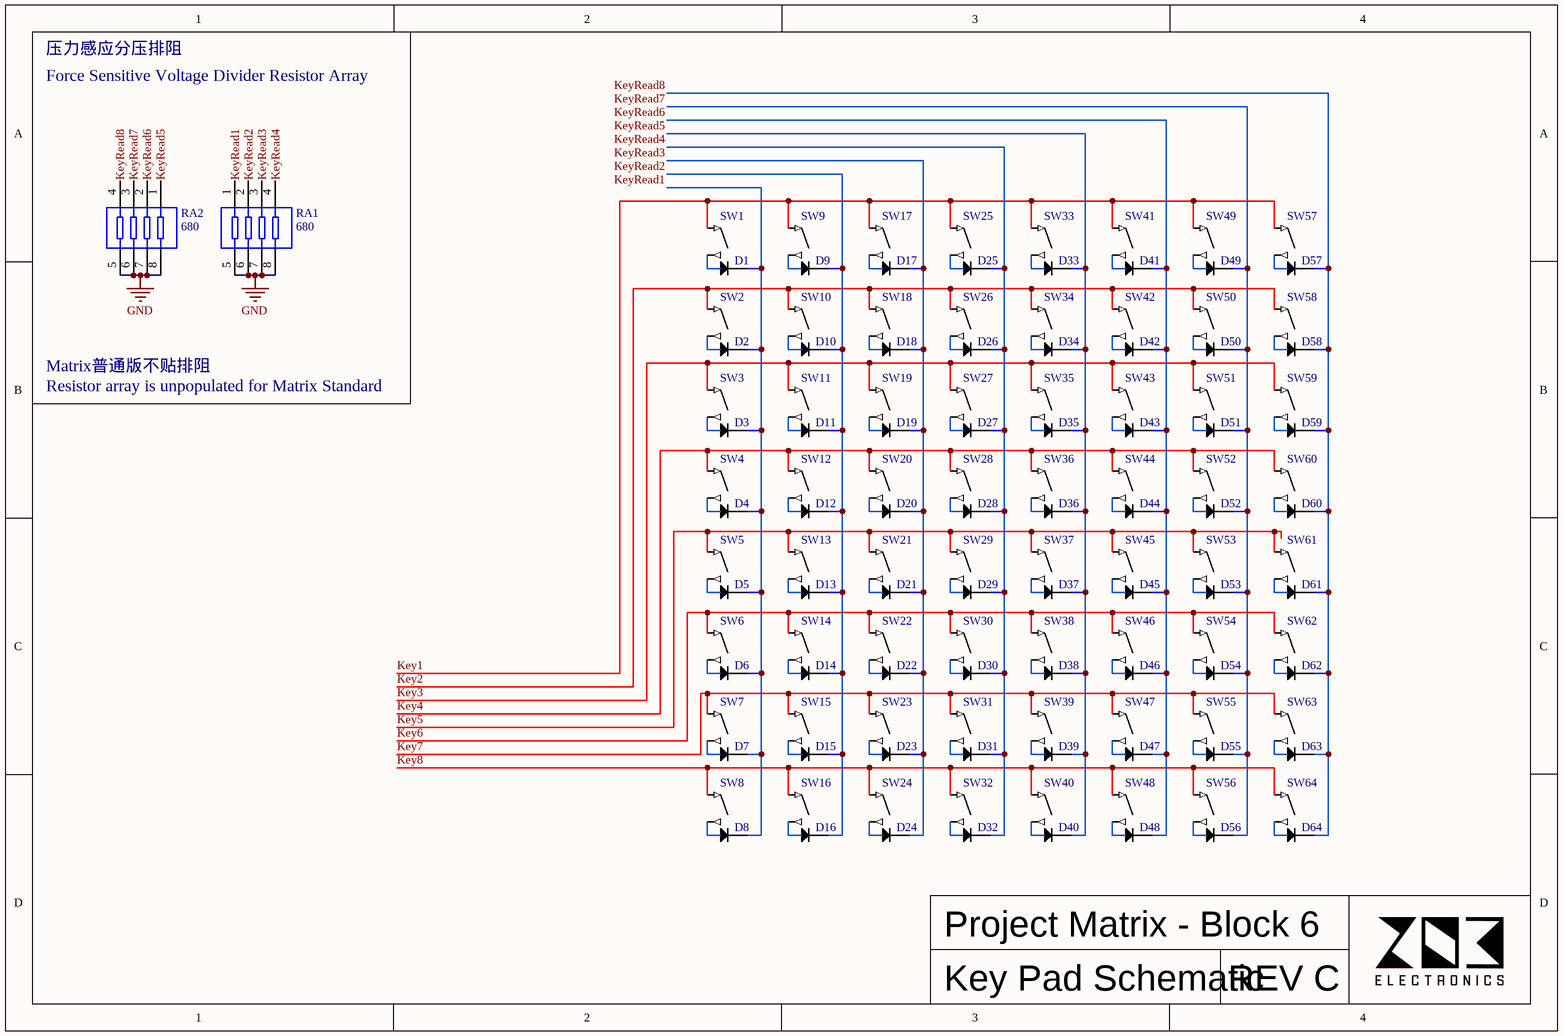
[diagram p3: Keypad.SchDoc]

### Parts
D1  1N4148  [SOD523]  (value not drawn)
D2  1N4148  [SOD523]  (value not drawn)
D3  1N4148  [SOD523]  (value not drawn)
D4  1N4148  [SOD523]  (value not drawn)
D5  1N4148  [SOD523]  (value not drawn)
D6  1N4148  [SOD523]  (value not drawn)
D7  1N4148  [SOD523]  (value not drawn)
D8  1N4148  [SOD523]  (value not drawn)
D9  1N4148  [SOD523]  (value not drawn)
D10  1N4148  [SOD523]  (value not drawn)
D11  1N4148  [SOD523]  (value not drawn)
D12  1N4148  [SOD523]  (value not drawn)
D13  1N4148  [SOD523]  (value not drawn)
D14  1N4148  [SOD523]  (value not drawn)
D15  1N4148  [SOD523]  (value not drawn)
D16  1N4148  [SOD523]  (value not drawn)
D17  1N4148  [SOD523]  (value not drawn)
D18  1N4148  [SOD523]  (value not drawn)
D19  1N4148  [SOD523]  (value not drawn)
D20  1N4148  [SOD523]  (value not drawn)
D21  1N4148  [SOD523]  (value not drawn)
D22  1N4148  [SOD523]  (value not drawn)
D23  1N4148  [SOD523]  (value not drawn)
D24  1N4148  [SOD523]  (value not drawn)
D25  1N4148  [SOD523]  (value not drawn)
D26  1N4148  [SOD523]  (value not drawn)
D27  1N4148  [SOD523]  (value not drawn)
D28  1N4148  [SOD523]  (value not drawn)
D29  1N4148  [SOD523]  (value not drawn)
D30  1N4148  [SOD523]  (value not drawn)
D31  1N4148  [SOD523]  (value not drawn)
D32  1N4148  [SOD523]  (value not drawn)
D33  1N4148  [SOD523]  (value not drawn)
D34  1N4148  [SOD523]  (value not drawn)
D35  1N4148  [SOD523]  (value not drawn)
D36  1N4148  [SOD523]  (value not drawn)
D37  1N4148  [SOD523]  (value not drawn)
D38  1N4148  [SOD523]  (value not drawn)
D39  1N4148  [SOD523]  (value not drawn)
D40  1N4148  [SOD523]  (value not drawn)
D41  1N4148  [SOD523]  (value not drawn)
D42  1N4148  [SOD523]  (value not drawn)
D43  1N4148  [SOD523]  (value not drawn)
D44  1N4148  [SOD523]  (value not drawn)
D45  1N4148  [SOD523]  (value not drawn)
D46  1N4148  [SOD523]  (value not drawn)
D47  1N4148  [SOD523]  (value not drawn)
D48  1N4148  [SOD523]  (value not drawn)
D49  1N4148  [SOD523]  (value not drawn)
D50  1N4148  [SOD523]  (value not drawn)
D51  1N4148  [SOD523]  (value not drawn)
D52  1N4148  [SOD523]  (value not drawn)
D53  1N4148  [SOD523]  (value not drawn)
D54  1N4148  [SOD523]  (value not drawn)
D55  1N4148  [SOD523]  (value not drawn)
D56  1N4148  [SOD523]  (value not drawn)
D57  1N4148  [SOD523]  (value not drawn)
D58  1N4148  [SOD523]  (value not drawn)
D59  1N4148  [SOD523]  (value not drawn)
D60  1N4148  [SOD523]  (value not drawn)
D61  1N4148  [SOD523]  (value not drawn)
D62  1N4148  [SOD523]  (value not drawn)
D63  1N4148  [SOD523]  (value not drawn)
D64  1N4148  [SOD523]  (value not drawn)
RA1  value 680  [8P4R]  (hidden comment: Touch Bar)
RA2  value 680  [8P4R]  (hidden comment: Touch Bar)
SW1  (no value)  [FSR Pad]
SW2  (no value)  [FSR Pad]
SW3  (no value)  [FSR Pad]
SW4  (no value)  [FSR Pad]
SW5  (no value)  [FSR Pad]
SW6  (no value)  [FSR Pad]
SW7  (no value)  [FSR Pad]
SW8  (no value)  [FSR Pad]
SW9  (no value)  [FSR Pad]
SW10  (no value)  [FSR Pad]
SW11  (no value)  [FSR Pad]
SW12  (no value)  [FSR Pad]
SW13  (no value)  [FSR Pad]
SW14  (no value)  [FSR Pad]
SW15  (no value)  [FSR Pad]
SW16  (no value)  [FSR Pad]
SW17  (no value)  [FSR Pad]
SW18  (no value)  [FSR Pad]
SW19  (no value)  [FSR Pad]
SW20  (no value)  [FSR Pad]
SW21  (no value)  [FSR Pad]
SW22  (no value)  [FSR Pad]
SW23  (no value)  [FSR Pad]
SW24  (no value)  [FSR Pad]
SW25  (no value)  [FSR Pad]
SW26  (no value)  [FSR Pad]
SW27  (no value)  [FSR Pad]
SW28  (no value)  [FSR Pad]
SW29  (no value)  [FSR Pad]
SW30  (no value)  [FSR Pad]
SW31  (no value)  [FSR Pad]
SW32  (no value)  [FSR Pad]
SW33  (no value)  [FSR Pad]
SW34  (no value)  [FSR Pad]
SW35  (no value)  [FSR Pad]
SW36  (no value)  [FSR Pad]
SW37  (no value)  [FSR Pad]
SW38  (no value)  [FSR Pad]
SW39  (no value)  [FSR Pad]
SW40  (no value)  [FSR Pad]
SW41  (no value)  [FSR Pad]
SW42  (no value)  [FSR Pad]
SW43  (no value)  [FSR Pad]
SW44  (no value)  [FSR Pad]
SW45  (no value)  [FSR Pad]
SW46  (no value)  [FSR Pad]
SW47  (no value)  [FSR Pad]
SW48  (no value)  [FSR Pad]
SW49  (no value)  [FSR Pad]
SW50  (no value)  [FSR Pad]
SW51  (no value)  [FSR Pad]
SW52  (no value)  [FSR Pad]
SW53  (no value)  [FSR Pad]
SW54  (no value)  [FSR Pad]
SW55  (no value)  [FSR Pad]
SW56  (no value)  [FSR Pad]
SW57  (no value)  [FSR Pad]
SW58  (no value)  [FSR Pad]
SW59  (no value)  [FSR Pad]
SW60  (no value)  [FSR Pad]
SW61  (no value)  [FSR Pad]
SW62  (no value)  [FSR Pad]
SW63  (no value)  [FSR Pad]
SW64  (no value)  [FSR Pad]

### Nets
GND: RA1.5 RA1.6 RA1.7 RA1.8 RA2.5 RA2.6 RA2.7 RA2.8
Key1: SW1.1 SW9.1 SW17.1 SW25.1 SW33.1 SW41.1 SW49.1 SW57.1
Key2: SW2.1 SW10.1 SW18.1 SW26.1 SW34.1 SW42.1 SW50.1 SW58.1
Key3: SW3.1 SW11.1 SW19.1 SW27.1 SW35.1 SW43.1 SW51.1 SW59.1
Key4: SW4.1 SW12.1 SW20.1 SW28.1 SW36.1 SW44.1 SW52.1 SW60.1
Key5: SW5.1 SW13.1 SW21.1 SW29.1 SW37.1 SW45.1 SW53.1 SW61.1
Key6: SW6.1 SW14.1 SW22.1 SW30.1 SW38.1 SW46.1 SW54.1 SW62.1
Key7: SW7.1 SW15.1 SW23.1 SW31.1 SW39.1 SW47.1 SW55.1 SW63.1
Key8: SW8.1 SW16.1 SW24.1 SW32.1 SW40.1 SW48.1 SW56.1 SW64.1
KeyRead1: D1.2 D2.2 D3.2 D4.2 D5.2 D6.2 D7.2 D8.2 RA1.1
KeyRead2: D9.2 D10.2 D11.2 D12.2 D13.2 D14.2 D15.2 D16.2 RA1.2
KeyRead3: D17.2 D18.2 D19.2 D20.2 D21.2 D22.2 D23.2 D24.2 RA1.3
KeyRead4: D25.2 D26.2 D27.2 D28.2 D29.2 D30.2 D31.2 D32.2 RA1.4
KeyRead5: D33.2 D34.2 D35.2 D36.2 D37.2 D38.2 D39.2 D40.2 RA2.1
KeyRead6: D41.2 D42.2 D43.2 D44.2 D45.2 D46.2 D47.2 D48.2 RA2.2
KeyRead7: D49.2 D50.2 D51.2 D52.2 D53.2 D54.2 D55.2 D56.2 RA2.3
KeyRead8: D57.2 D58.2 D59.2 D60.2 D61.2 D62.2 D63.2 D64.2 RA2.4
NetD1_1: D1.1 SW1.2(Out)
NetD2_1: D2.1 SW2.2(Out)
NetD3_1: D3.1 SW3.2(Out)
NetD4_1: D4.1 SW4.2(Out)
NetD5_1: D5.1 SW5.2(Out)
NetD6_1: D6.1 SW6.2(Out)
NetD7_1: D7.1 SW7.2(Out)
NetD8_1: D8.1 SW8.2(Out)
NetD9_1: D9.1 SW9.2(Out)
NetD10_1: D10.1 SW10.2(Out)
NetD11_1: D11.1 SW11.2(Out)
NetD12_1: D12.1 SW12.2(Out)
NetD13_1: D13.1 SW13.2(Out)
NetD14_1: D14.1 SW14.2(Out)
NetD15_1: D15.1 SW15.2(Out)
NetD16_1: D16.1 SW16.2(Out)
NetD17_1: D17.1 SW17.2(Out)
NetD18_1: D18.1 SW18.2(Out)
NetD19_1: D19.1 SW19.2(Out)
NetD20_1: D20.1 SW20.2(Out)
NetD21_1: D21.1 SW21.2(Out)
NetD22_1: D22.1 SW22.2(Out)
NetD23_1: D23.1 SW23.2(Out)
NetD24_1: D24.1 SW24.2(Out)
NetD25_1: D25.1 SW25.2(Out)
NetD26_1: D26.1 SW26.2(Out)
NetD27_1: D27.1 SW27.2(Out)
NetD28_1: D28.1 SW28.2(Out)
NetD29_1: D29.1 SW29.2(Out)
NetD30_1: D30.1 SW30.2(Out)
NetD31_1: D31.1 SW31.2(Out)
NetD32_1: D32.1 SW32.2(Out)
NetD33_1: D33.1 SW33.2(Out)
NetD34_1: D34.1 SW34.2(Out)
NetD35_1: D35.1 SW35.2(Out)
NetD36_1: D36.1 SW36.2(Out)
NetD37_1: D37.1 SW37.2(Out)
NetD38_1: D38.1 SW38.2(Out)
NetD39_1: D39.1 SW39.2(Out)
NetD40_1: D40.1 SW40.2(Out)
NetD41_1: D41.1 SW41.2(Out)
NetD42_1: D42.1 SW42.2(Out)
NetD43_1: D43.1 SW43.2(Out)
NetD44_1: D44.1 SW44.2(Out)
NetD45_1: D45.1 SW45.2(Out)
NetD46_1: D46.1 SW46.2(Out)
NetD47_1: D47.1 SW47.2(Out)
NetD48_1: D48.1 SW48.2(Out)
NetD49_1: D49.1 SW49.2(Out)
NetD50_1: D50.1 SW50.2(Out)
NetD51_1: D51.1 SW51.2(Out)
NetD52_1: D52.1 SW52.2(Out)
NetD53_1: D53.1 SW53.2(Out)
NetD54_1: D54.1 SW54.2(Out)
NetD55_1: D55.1 SW55.2(Out)
NetD56_1: D56.1 SW56.2(Out)
NetD57_1: D57.1 SW57.2(Out)
NetD58_1: D58.1 SW58.2(Out)
NetD59_1: D59.1 SW59.2(Out)
NetD60_1: D60.1 SW60.2(Out)
NetD61_1: D61.1 SW61.2(Out)
NetD62_1: D62.1 SW62.2(Out)
NetD63_1: D63.1 SW63.2(Out)
NetD64_1: D64.1 SW64.2(Out)

### Notes on the sheet
- 压力感应分压排阻
- Force Sensitive Voltage Divider Resistor Array
- Matrix普通版不贴排阻
- Resistor array is unpopulated for Matrix Standard
- Project Matrix - Block 6
- Key Pad Schematic
- REV C

### Library data of the parts
RA1 RA2 = 4R8P Resistor
SW1-SW64 = SW

## Nets that join several sheets
GND: Underglow (64 pins), LED (128 pins), Main (80 pins), Keypad (8 pins)
VSYS: Underglow (64 pins), LED (128 pins), Main (BATTERY.7 PD1.2 PD2.1)
Key1: Main (MCU.25), Keypad (8 pins)
Key2: Main (MCU.21), Keypad (8 pins)
Key3: Main (MCU.5), Keypad (8 pins)
Key4: Main (MCU.10), Keypad (8 pins)
Key5: Main (MCU.16), Keypad (8 pins)
Key6: Main (MCU.17), Keypad (8 pins)
Key7: Main (MCU.18), Keypad (8 pins)
Key8: Main (MCU.19), Keypad (8 pins)
KeyRead1: Main (MCU.6), Keypad (9 pins)
KeyRead2: Main (MCU.7), Keypad (9 pins)
KeyRead3: Main (MCU.8), Keypad (9 pins)
KeyRead4: Main (MCU.9), Keypad (9 pins)
KeyRead5: Main (MCU.11), Keypad (9 pins)
KeyRead6: Main (MCU.12), Keypad (9 pins)
KeyRead7: Main (MCU.13), Keypad (9 pins)
KeyRead8: Main (MCU.14), Keypad (9 pins)
LEDdata: LED (LED1.4), Main (MCU.34)
Underglow: Underglow (LED65.4), LED (LED64.2)